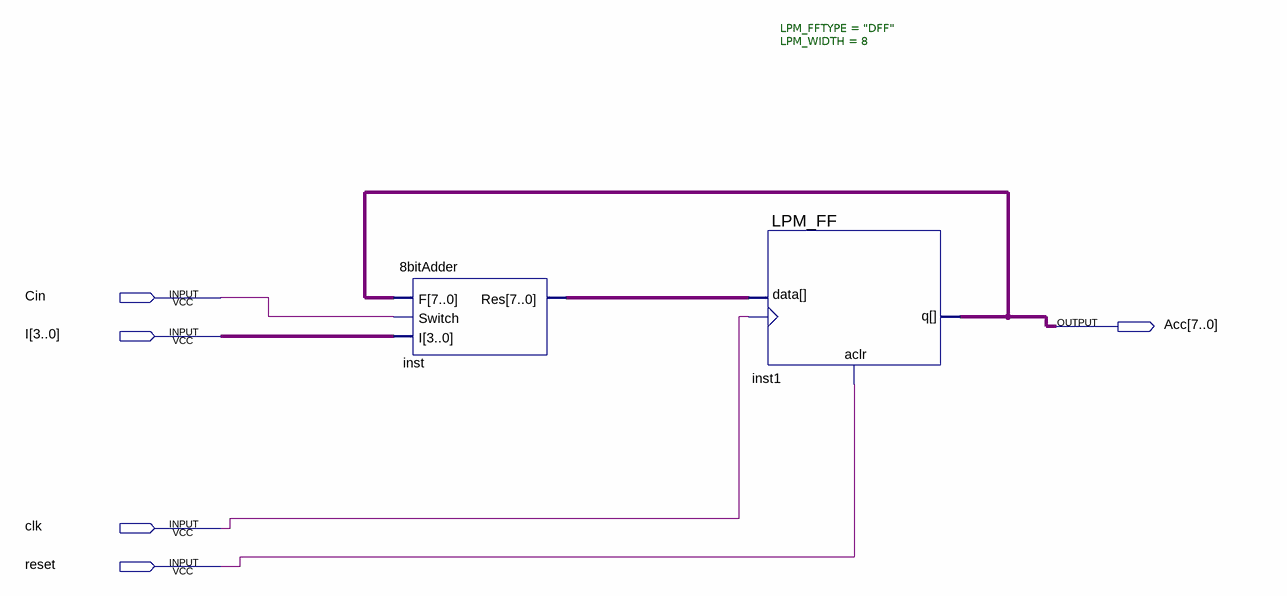
[diagram p0: schematic sheet]
// Quartus schematic Accumulator.bdf as structural Verilog: 2 symbols, 5 pins
module Accumulator (
  input  Cin,
  input  [3:0] I,
  input  clk,
  input  reset,
  output [7:0] Acc
);

  wire [7:0] inst_res;

  \8bitAdder  inst (.F(Acc), .Switch(Cin), .I(I), .Res(inst_res));
  LPM_FF #(.LPM_FFTYPE("DFF"), .LPM_WIDTH(8)) inst1 (.aclr(reset), .clock(clk), .data(inst_res), .q(Acc));
endmodule
